# Altium project Middle board.PrjPcb
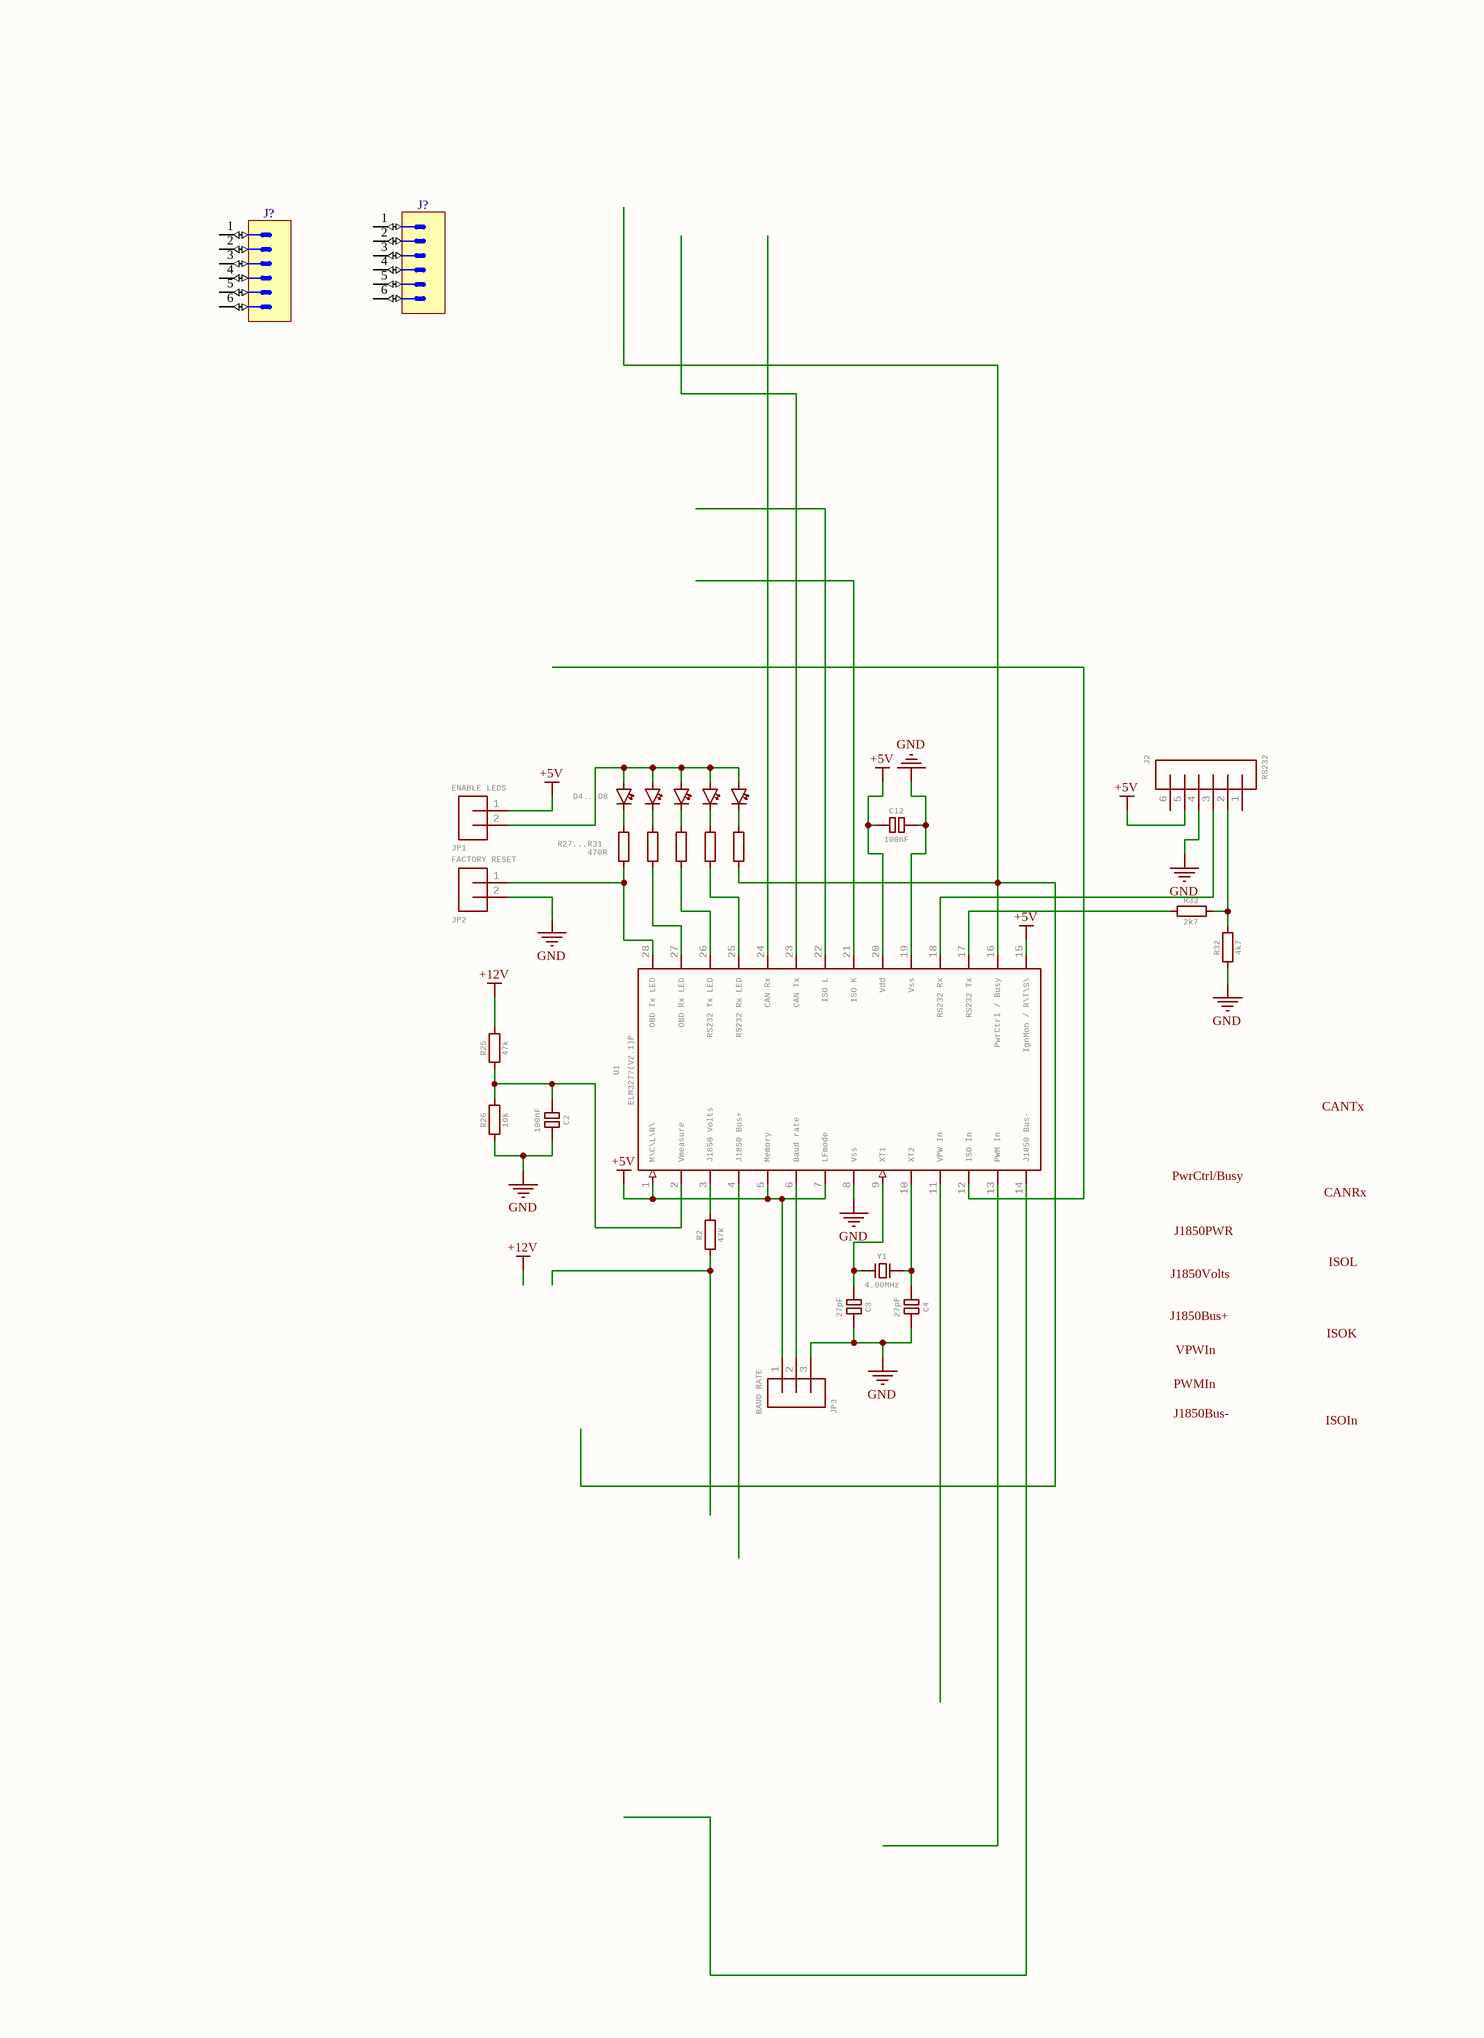
[diagram p0: Middle board.SchDoc]
1 sheet, 27 parts. Net scope: global (net labels, ports and power ports of the same name join across sheets).
Board file: Middle board.PcbDoc

## Sheet Middle board.SchDoc
size 260 x 358 mm; Origin: Eagle; OriginPath: C:\Users\Bimbo\Downloads\ELM327-based OBD-II interface.sch; OriginSheet: 1

### Parts
(Parts that share a designator on the sheet are numbered #1, #2 ... from top to bottom, then left to right.)
C2  100nF  [MLCC-5.08]
C3  27pF  [MLCC-5.08]
C4  27pF  [MLCC-5.08]
C12  100nF  [MLCC-5.08]
D4  OBD Tx  [LED_5MM]  (value not drawn)
D5  OBD Rx  [LED_5MM]  (value not drawn)
D6  RS232 Tx  [LED_5MM]  (value not drawn)
D7  RS232 Rx  [LED_5MM]  (value not drawn)
D8  ON  [LED_5MM]  (value not drawn)
J2  RS232  [HEADER_1X6]
J?#1  Header 6  [3M_961106-6404-AR]  (value not drawn)
J?#2  Header 6  [3M_961106-6404-AR]  (value not drawn)
JP1  ENABLE LEDS  [HEADER_1X2]
JP2  FACTORY RESET  [HEADER_1X2]
JP3  BAUD RATE  [HEADER_1X3]
R2  47k  [MF12-1/8W]
R25  47k  [MF12-1/8W]
R26  10k  [MF12-1/8W]
R27  470R  [MF12-1/8W]  (value not drawn)
R28  470R  [MF12-1/8W]  (value not drawn)
R29  470R  [MF12-1/8W]  (value not drawn)
R30  470R  [MF12-1/8W]  (value not drawn)
R31  470R  [MF12-1/8W]  (value not drawn)
R32  4k7  [MF12-1/8W]
R33  2k7  [MF12-1/8W]
U1  ELM327?(V2.1)P  !MCLR: M\C\L\R\  J1850Volts: J1850 Volts  J1850Bus+: J1850 Bus+  Baudrate: Baud rate  VPWIn: VPW In  ISOIn: ISO In  PWMIn: PWM In  J1850Bus-: J1850 Bus-  OBDTxLED: OBD Tx LED  OBDRxLED: OBD Rx LED  RS232TxLED: RS232 Tx LED  RS232RxLED: RS232 Rx LED  CANRx: CAN Rx  CANTx: CAN Tx  ISOL: ISO L  ISOK: ISO K  RS232Rx: RS232 Rx  RS232Tx: RS232 Tx  PwrCtrl/Busy: PwrCtrl / Busy  IgnMon/!RTS: IgnMon / R\T\S\  [SPDIP(28)]
Y1  4.00MHz  [HC49]

### Nets
+5V: C12.+ J2.5 JP1.1 JP3.1 U1.1(~{MCLR}) U1.5(MEMORY) U1.7(LFMODE) U1.15(IGNMON/~{RTS}) U1.20(VDD)
+12V: R25.2
GND: C2.- C3.- C4.- C12.- J2.4 JP2.2 JP3.3 R26.1 R32.1 U1.8(VSS) U1.19(VSS)
NetC2_+: C2.+ R25.1 R26.2 U1.2(VMEASURE)
NetC3_+: C3.+ U1.9(XT1) Y1.1
NetC4_+: C4.+ U1.10(XT2) Y1.2
NetD4_A: D4.A D5.A D6.A D7.A D8.A JP1.2
NetD4_C: D4.C R27.2
NetD5_C: D5.C R28.2
NetD6_C: D6.C R29.2
NetD7_C: D7.C R30.2
NetD8_C: D8.C R31.2
NetJ2_2: J2.2 R32.2 R33.2
NetJ2_3: J2.3 U1.18(RS232_RX)
NetJP2_1: JP2.1 R27.1 U1.28(OBD_TX_LED)
NetJP3_2: JP3.2 U1.6(BAUD_RATE)
NetR2_2: R2.2 U1.3(J1850_VOLTS)
NetR28_1: R28.1 U1.27(OBD_RX_LED)
NetR29_1: R29.1 U1.26(RS232_TX_LED)
NetR30_1: R30.1 U1.25(RS232_RX_LED)
NetR31_1: R31.1 U1.16(PWRCTRL/BUSY)
NetR33_1: R33.1 U1.17(RS232_TX)

Not connected (* = marked no-connect by the designer): J2 1 6; J?#1 1 2 3 4 5 6; J?#2 1 2 3 4 5 6; R2 1; U1 4(J1850_BUS+) 11(VPW_IN) 12(ISO_IN) 13(PWM_IN) 14(J1850_BUS-) 21(ISO_K) 22(ISO_L) 23(CAN_TX) 24(CAN_RX)

### Notes on the sheet
- (near D4) D4...D8
- (near R27) R27...R31
  470R
- Labels drawn without touching a wire or pin: CANRx, CANTx, ISOIn, ISOK, ISOL, J1850Bus+, J1850Bus-, J1850PWR, J1850Volts, PWMIn, PwrCtrl/Busy, VPWIn

### Library data of the parts
C2-C4 C12 = C(MLCC-5.08): GateName_1: G$1; SymbolName_1: C; DeviceName: (MLCC-5.08); LibraryName: Capacitor; DeviceSetName: C
D4-D8 = LED(?)5MM: GateName_1: G$1; SymbolName_1: LED; DeviceName: 5MM; DeviceSetName: LED(?); LibraryName: diode
J2 = HEADER_1X6: GateName_1: G$1; SymbolName_1: HEADER_1X6; LibraryName: HEADERS; DeviceSetName: HEADER_1X6
J?#1 J?#2 = 3M_961106-6404-AR: Connector 6 Male; Part Description: 6 Contacts, Straight .100" x .100" Pin Strip Header, 961 Series; Manufacturer: 3M; PressFit: No; Part Number: 3M_961106-6404-AR; Component Kind: Standard; Component Type: Standard; Pin Count: 6; Family: Header 6; Mounted: Yes; Socket: No; SMD: No; Sense: No; Status: None; Manufacturer Part Number: 961106-6404-AR; ComponentHeight: 8mm; HelpURL: \\cern.ch\dfs\Applications\Altium\Datasheets\3M_961106-6404-AR.pdf; Author: CERN DEM MR; CreateDate: 05.09.2016; LatestRevisionDate: 05.09.2016
JP1 JP2 = HEADER_1X2: GateName_1: G$1; SymbolName_1: HEADER_1X2; LibraryName: HEADERS; DeviceSetName: HEADER_1X2
JP3 = HEADER_1X3: GateName_1: G$1; SymbolName_1: HEADER_1X3; LibraryName: HEADERS; DeviceSetName: HEADER_1X3
R2 R25-R33 = R-EU-?MF12-1/8W: GateName_1: G$1; SymbolName_1: R-EU; DeviceSetName: R-EU-?; DeviceName: MF12-1/8W; LibraryName: Resistor
U1 = ELM327?(V2.1)P: ELM327 - OBD to RS232 Interpreter (v2.1) based on Microchip Technology Inc.'s PIC18F2480 (www.microchip.com)    All versions of the ELM327 support the standard OBDII protocols. In addition, the IC supports various other protocols to varying degrees.   Version 2.1 is the most recent revision.   More info on Elm Electronics Inc..; GateName_1: G$1; SymbolName_1: ELM327-V2.1; DeviceName: P; LibraryName: Elm Electronics; DeviceSetName: ELM327?(V2.1); Vmeasure: Vmeasure; Memory: Memory; LFmode: LFmode; Vss: Vss; XT1: XT1; XT2: XT2; Vdd: Vdd
Y1 = HUS-4.000-18-30/50/-40+85: GateName_1: G$1; SymbolName_1: CRYSTAL; LibraryName: crystal; DeviceSetName: HUS-4.000-18-30/50/-40+85